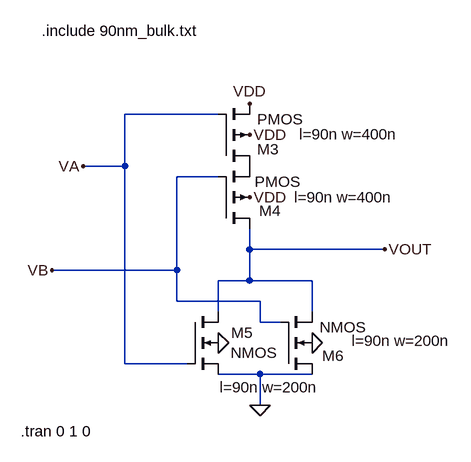
[diagram p0: schematic nor3.asc]
nor3.asc, the LTspice schematic file:
Version 4
SHEET 1 880 680
WIRE -656 -16 -800 -16
WIRE -800 64 -800 -16
WIRE -800 64 -864 64
WIRE -656 80 -720 80
WIRE -608 192 -608 160
WIRE -400 192 -608 192
WIRE -720 224 -720 80
WIRE -720 224 -912 224
WIRE -608 240 -608 192
WIRE -608 240 -656 240
WIRE -512 240 -608 240
WIRE -720 272 -720 224
WIRE -592 272 -720 272
WIRE -656 288 -656 240
WIRE -512 288 -512 240
WIRE -592 304 -592 272
WIRE -560 304 -592 304
WIRE -800 368 -800 64
WIRE -704 368 -800 368
WIRE -592 384 -656 384
WIRE -512 384 -592 384
WIRE -592 432 -592 384
FLAG -592 432 0
FLAG -400 192 VOUT
FLAG -608 -32 VDD
FLAG -608 16 VDD
FLAG -608 112 VDD
FLAG -656 336 0
FLAG -512 336 0
FLAG -864 64 VA
FLAG -912 224 VB
SYMBOL pmos4 -656 64 M180
WINDOW 0 60 26 Left 2
WINDOW 3 60 72 Left 2
WINDOW 123 124 49 Left 2
SYMATTR InstName M3
SYMATTR Value2 l=90n w=400n
SYMBOL pmos4 -656 160 M180
WINDOW 0 63 27 Left 2
WINDOW 123 117 48 Left 2
SYMATTR InstName M4
SYMATTR Value2 l=90n w=400n
SYMBOL nmos4 -704 288 R0
WINDOW 0 68 32 Left 2
WINDOW 3 67 63 Left 2
WINDOW 123 50 116 Left 2
SYMATTR InstName M5
SYMATTR Value2 l=90n w=200n
SYMBOL nmos4 -560 384 M180
WINDOW 0 64 28 Left 2
WINDOW 3 60 72 Left 2
WINDOW 123 109 51 Left 2
SYMATTR InstName M6
SYMATTR Value2 l=90n w=200n
TEXT -928 -144 Left 2 !.include 90nm_bulk.txt
TEXT -960 472 Left 2 !.tran 0 1 0

The netlist it stands for:
* nor3.asc
M3 P001 VA VDD VDD PMOS l=90n w=400n
M4 VOUT VB P001 VDD PMOS l=90n w=400n
M5 VOUT VA 0 0 NMOS l=90n w=200n
M6 0 VB VOUT 0 NMOS l=90n w=200n
.model NMOS NMOS
.model PMOS PMOS
.lib standard.mos
.include 90nm_bulk.txt
.tran 0 1 0
.backanno
.end